# EAGLE design v2 (EAGLE 6.1)
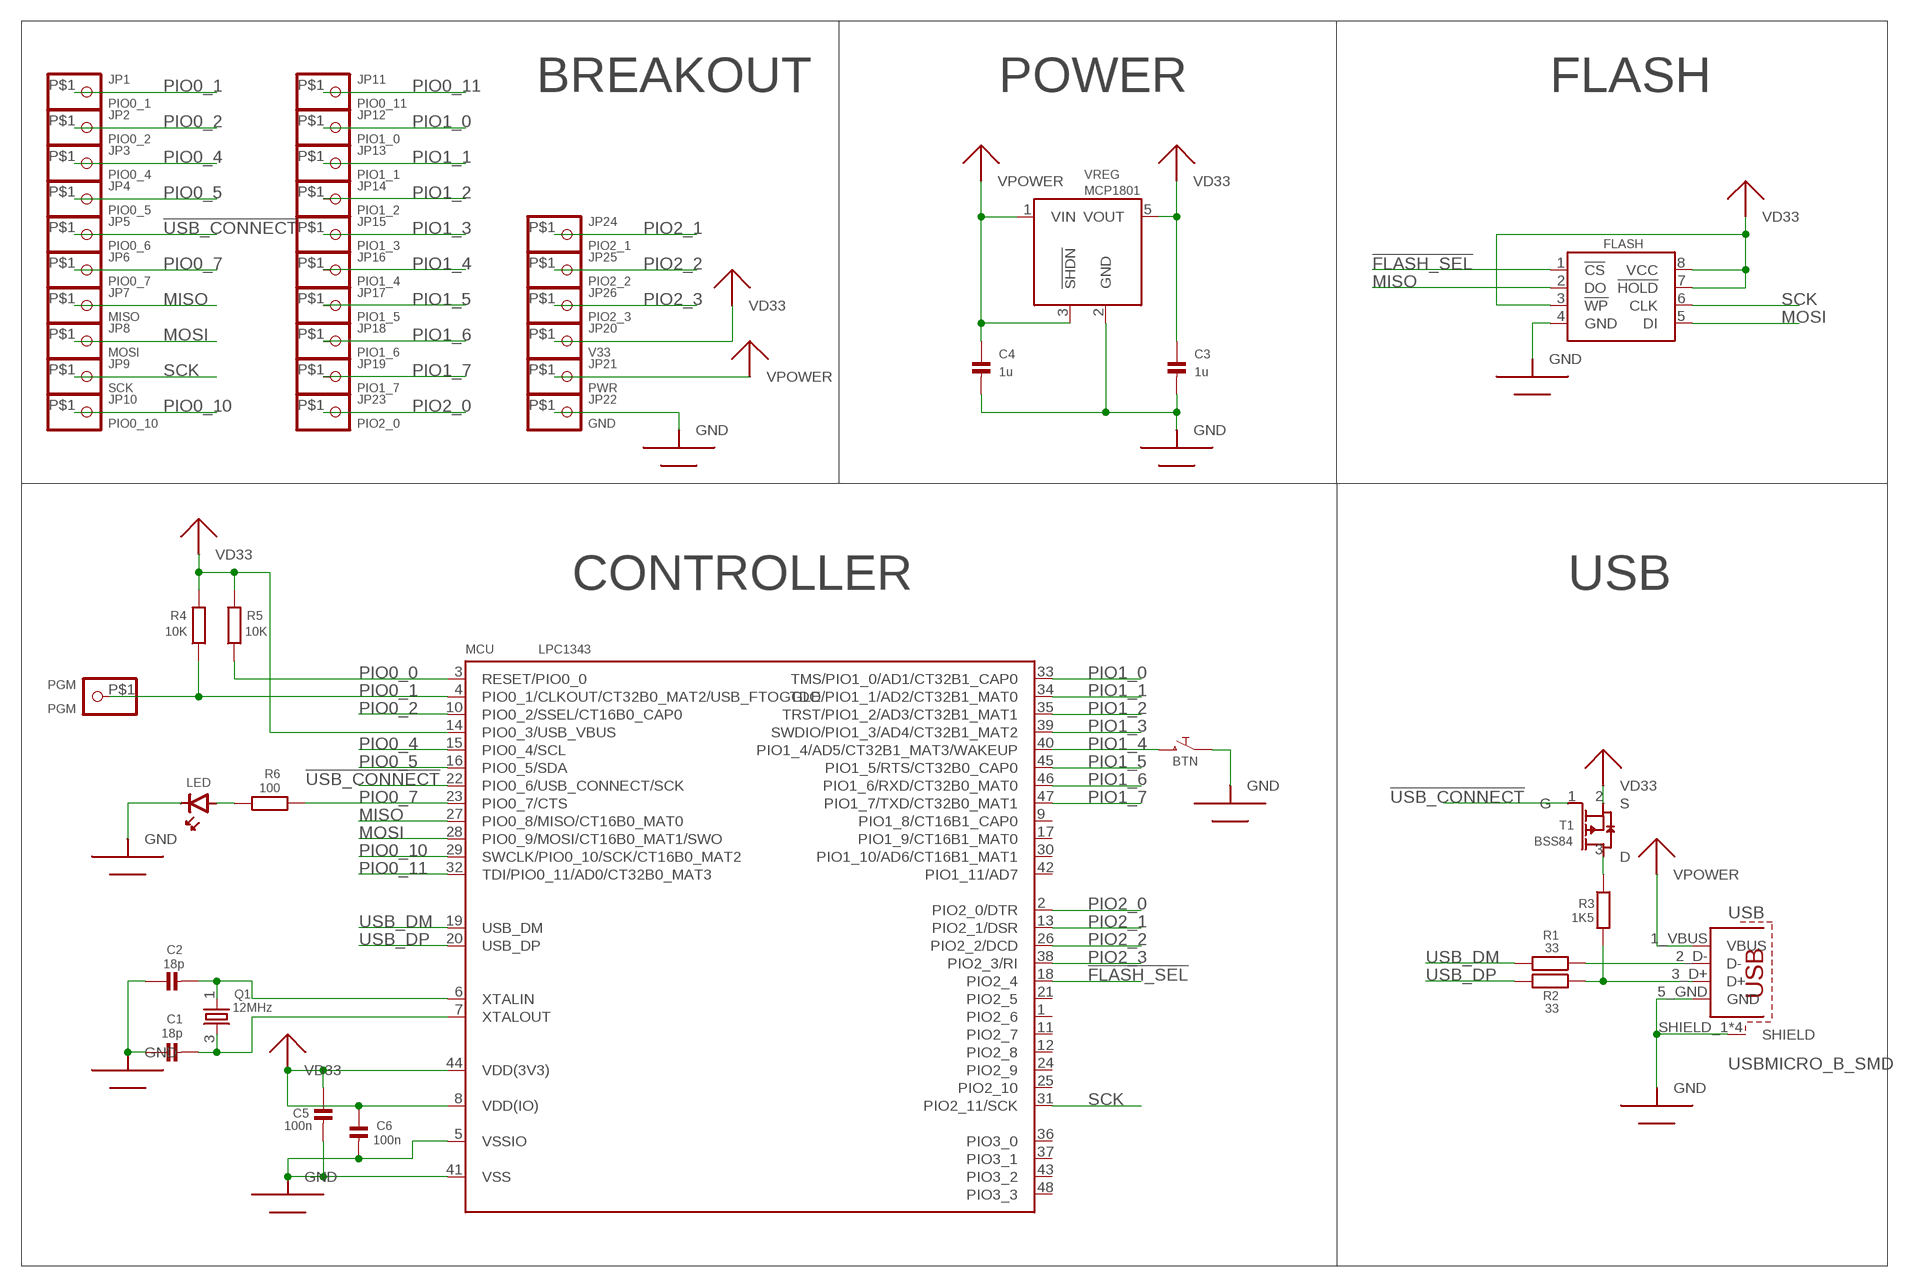
[diagram p0: schematic, sheet 1]

## Parts
BTN  PUSHBUTTONEVQP0  [EVQP0]
C1  18p  CAP_CERAMIC0805_MICROMELF_COMBO  [0805_MICROMELF_COMBO]
C2  18p  CAP_CERAMIC0805_MICROMELF_COMBO  [0805_MICROMELF_COMBO]
C3  1u  CAP_CERAMIC0805_MICROMELF_COMBO  [0805_MICROMELF_COMBO]
C4  1u  CAP_CERAMIC0805_MICROMELF_COMBO  [0805_MICROMELF_COMBO]
C5  100n  CAP_CERAMIC0805_MICROMELF_COMBO  [0805_MICROMELF_COMBO]
C6  100n  CAP_CERAMIC0805_MICROMELF_COMBO  [0805_MICROMELF_COMBO]
FLASH  SERIALFLASHSOIC8-150MIL  [SOIC8-150MIL]
JP1  PIO0_1  HEADER-1X1SMD_MEDIUM  [PCB_MEDIUM_RECT_PAD]
JP2  PIO0_2  HEADER-1X1SMD_MEDIUM  [PCB_MEDIUM_RECT_PAD]
JP3  PIO0_4  HEADER-1X1SMD_MEDIUM  [PCB_MEDIUM_RECT_PAD]
JP4  PIO0_5  HEADER-1X1SMD_MEDIUM  [PCB_MEDIUM_RECT_PAD]
JP5  PIO0_6  HEADER-1X1SMD_MEDIUM  [PCB_MEDIUM_RECT_PAD]
JP6  PIO0_7  HEADER-1X1SMD_MEDIUM  [PCB_MEDIUM_RECT_PAD]
JP7  MISO  HEADER-1X1SMD_MEDIUM  [PCB_MEDIUM_RECT_PAD]
JP8  MOSI  HEADER-1X1SMD_MEDIUM  [PCB_MEDIUM_RECT_PAD]
JP9  SCK  HEADER-1X1SMD_MEDIUM  [PCB_MEDIUM_RECT_PAD]
JP10  PIO0_10  HEADER-1X1SMD_MEDIUM  [PCB_MEDIUM_RECT_PAD]
JP11  PIO0_11  HEADER-1X1SMD_MEDIUM  [PCB_MEDIUM_RECT_PAD]
JP12  PIO1_0  HEADER-1X1SMD_MEDIUM  [PCB_MEDIUM_RECT_PAD]
JP13  PIO1_1  HEADER-1X1SMD_MEDIUM  [PCB_MEDIUM_RECT_PAD]
JP14  PIO1_2  HEADER-1X1SMD_MEDIUM  [PCB_MEDIUM_RECT_PAD]
JP15  PIO1_3  HEADER-1X1SMD_MEDIUM  [PCB_MEDIUM_RECT_PAD]
JP16  PIO1_4  HEADER-1X1SMD_MEDIUM  [PCB_MEDIUM_RECT_PAD]
JP17  PIO1_5  HEADER-1X1SMD_MEDIUM  [PCB_MEDIUM_RECT_PAD]
JP18  PIO1_6  HEADER-1X1SMD_MEDIUM  [PCB_MEDIUM_RECT_PAD]
JP19  PIO1_7  HEADER-1X1SMD_MEDIUM  [PCB_MEDIUM_RECT_PAD]
JP20  V33  HEADER-1X1SMD_MEDIUM  [PCB_MEDIUM_RECT_PAD]
JP21  PWR  HEADER-1X1SMD_MEDIUM  [PCB_MEDIUM_RECT_PAD]
JP22  GND  HEADER-1X1SMD_MEDIUM  [PCB_MEDIUM_RECT_PAD]
JP23  PIO2_0  HEADER-1X1SMD_MEDIUM  [PCB_MEDIUM_RECT_PAD]
JP24  PIO2_1  HEADER-1X1SMD_MEDIUM  [PCB_MEDIUM_RECT_PAD]
JP25  PIO2_2  HEADER-1X1SMD_MEDIUM  [PCB_MEDIUM_RECT_PAD]
JP26  PIO2_3  HEADER-1X1SMD_MEDIUM  [PCB_MEDIUM_RECT_PAD]
LED  LED0805  [0805_POLAR]
MCU  LPC1343  LPC1343_QFP  [LQFP48]
PGM  PGM  HEADER-1X1SMD_MEDIUM  [PCB_MEDIUM_RECT_PAD]
Q1  12MHz  QUARTZABM8G  [ABM8G]
R1  33  R-EU_0805_MICROMELF_COMBO  [0805_MICROMELF_COMBO]
R2  33  R-EU_0805_MICROMELF_COMBO  [0805_MICROMELF_COMBO]
R3  1K5  R-EU_0805_MICROMELF_COMBO  [0805_MICROMELF_COMBO]
R4  10K  R-EU_0805_MICROMELF_COMBO  [0805_MICROMELF_COMBO]
R5  10K  R-EU_0805_MICROMELF_COMBO  [0805_MICROMELF_COMBO]
R6  100  R-EU_0805_MICROMELF_COMBO  [0805_MICROMELF_COMBO]
T1  BSS84  PMOS_ENH  [SOT23]
USB  USBMICRO_B_SMD  [MICRO_USB_B_SMD]
VREG  MCP1801  MCP180XSOT-23-5  [SOT-23-5]

## Nets
!FLASH_SEL: FLASH.1(!CS) MCU.18(PIO2_4)
!USB_CONNECT: JP5.P$1 MCU.22(PIO0_6/USB_CONNECT/SCK) T1.1(G)
GND: BTN.A C1.1 C2.1 C3.2 C4.2 C5.2 C6.2 FLASH.4(GND) JP22.P$1 LED.K(CATHODE) MCU.5(VSSIO) MCU.41(VSS) USB.5_GND(GND) USB.SHIELD_1(SHIELD) USB.SHIELD_2(SHIELD) USB.SHIELD_3(SHIELD) USB.SHIELD_4(SHIELD) VREG.2(GND)
MISO: FLASH.2(DO) JP7.P$1 MCU.27(PIO0_8/MISO/CT16B0_MAT0)
MOSI: FLASH.5(DI) JP8.P$1 MCU.28(PIO0_9/MOSI/CT16B0_MAT1/SWO)
N$1: C2.2 MCU.6(XTALIN) Q1.1
N$2: C1.2 MCU.7(XTALOUT) Q1.3
N$3: R3.1 T1.3(D)
N$4: R1.1 USB.2_D-(D-)
N$5: LED.A(ANODE) R6.1
PIO0_0: MCU.3(RESET/PIO0_0) R5.1
PIO0_1: JP1.P$1 MCU.4(PIO0_1/CLKOUT/CT32B0_MAT2/USB_FTOGGLE) PGM.P$1 R4.1
PIO0_2: JP2.P$1 MCU.10(PIO0_2/SSEL/CT16B0_CAP0)
PIO0_4: JP3.P$1 MCU.15(PIO0_4/SCL)
PIO0_5: JP4.P$1 MCU.16(PIO0_5/SDA)
PIO0_7: JP6.P$1 MCU.23(PIO0_7/CTS) R6.2
PIO0_10: JP10.P$1 MCU.29(SWCLK/PIO0_10/SCK/CT16B0_MAT2)
PIO0_11: JP11.P$1 MCU.32(TDI/PIO0_11/AD0/CT32B0_MAT3)
PIO1_0: JP12.P$1 MCU.33(TMS/PIO1_0/AD1/CT32B1_CAP0)
PIO1_1: JP13.P$1 MCU.34(TDO/PIO1_1/AD2/CT32B1_MAT0)
PIO1_2: JP14.P$1 MCU.35(TRST/PIO1_2/AD3/CT32B1_MAT1)
PIO1_3: JP15.P$1 MCU.39(SWDIO/PIO1_3/AD4/CT32B1_MAT2)
PIO1_4: BTN.B JP16.P$1 MCU.40(PIO1_4/AD5/CT32B1_MAT3/WAKEUP)
PIO1_5: JP17.P$1 MCU.45(PIO1_5/RTS/CT32B0_CAP0)
PIO1_6: JP18.P$1 MCU.46(PIO1_6/RXD/CT32B0_MAT0)
PIO1_7: JP19.P$1 MCU.47(PIO1_7/TXD/CT32B0_MAT1)
PIO2_0: JP23.P$1 MCU.2(PIO2_0/DTR)
PIO2_1: JP24.P$1 MCU.13(PIO2_1/DSR)
PIO2_2: JP25.P$1 MCU.26(PIO2_2/DCD)
PIO2_3: JP26.P$1 MCU.38(PIO2_3/RI)
SCK: FLASH.6(CLK) JP9.P$1 MCU.31(PIO2_11/SCK)
USB_D+: R2.1 R3.2 USB.3_D+(D+)
USB_DM: MCU.19(USB_DM) R1.2
USB_DP: MCU.20(USB_DP) R2.2
VD33: C3.1 C5.1 C6.1 FLASH.3(!WP) FLASH.7(!HOLD) FLASH.8(VCC) JP20.P$1 MCU.8(VDD(IO)) MCU.14(PIO0_3/USB_VBUS) MCU.44(VDD(3V3)) R4.2 R5.2 T1.2(S) VREG.5(VOUT)
VPOWER: C4.1 JP21.P$1 USB.1_VBUS(VBUS) VREG.1(VIN) VREG.3(!SHDN)
Unconnected: MCU.1(PIO2_6) MCU.9(PIO1_8/CT16B1_CAP0) MCU.11(PIO2_7) MCU.12(PIO2_8) MCU.17(PIO1_9/CT16B1_MAT0) MCU.21(PIO2_5) MCU.24(PIO2_9) MCU.25(PIO2_10) MCU.30(PIO1_10/AD6/CT16B1_MAT1) MCU.36(PIO3_0) MCU.37(PIO3_1) MCU.42(PIO1_11/AD7) MCU.43(PIO3_2) MCU.48(PIO3_3)

## Notes on the sheet
- BREAKOUT | POWER | FLASH
- CONTROLLER | USB

## Library data of the parts
BTN = MEINZEUG:PUSHBUTTON: Push button 1 x momentary close switches
C1-C6 = MEINZEUG:CAP_CERAMIC: Ceramic Capacitors 0603 - 0603 Surface Mount Capacitors 3pF 250V +/-0.1pF RF Ceramic Capacitor[Digikey: 712-1347-1-ND] 16 pF 50V 5% Ceramic Capacitor[Digikey: 445-5051-2-ND] 18 pF 250V 5% RF Ceramic Capcitor [Digikey: 478-3505-1-ND] 22 pF 50V Ceramic Capacitor [Digikey: PCC220ACVTR-ND] 33 pF 50V 5% Ceramic Capacitor 56 pF 250V 5% C0G RF Ceramic Capcitor [Digikey: 490-4867-1-ND] 680 pF 50V Ceramic Capacitor 2200 pF 50V 5% C0G Ceramic Capacitor [Digikey: 445-1297-1-ND] 5600 pF 100V 5% X7R Ceramic Capacitor [Digikey: 478-3711-1-ND] 0.1 µF 25V 10% Ceramic Capacitor [Digikey: PCC2277TR-ND] 0.22 µF 16V 10% X7R Ceramic Capacitor [Digikey: 445-1318-1-ND] 1.0 µF 25V 10% Ceramic Capacitor [Digikey: 445-5146-2-ND] 0805 - 0805 Surface Mount Capacitors 220 pF 250V 2% RF Ceramic Capacitor [Digikey: 712-1398-1-ND] 1000 pF 50V 2% NP0 Ceramic Capacitor [Digikey: 478-3760-1-ND] 0.1 µF 25V 10% Ceramic Capacitor [Digikey: PCC1828TR-ND] 1.0 µF 16V 10% Ceramic Capacitor[Digikey: 490-1691-2-ND] 10.0 µF 10V 10% Ceramic Capacitor[Digikey: 709-1228-1-ND] 1206 - 1206 Surface Mount Capacitors
FLASH = MEINZEUG:SERIALFLASH: SPI flash chip. Uses common pinout (Winbond, Macronix, Microchip, Numonyx, ...) - check for different pinouts (e.g. Atmel)
JP1-JP26 PGM = MEINZEUG:HEADER-1X1: PIN HEADER
LED = MEINZEUG:LED: LED common
MCU = MEINZEUG:LPC1343_QFP: LPC1343 72 MHz 32-bit ARM Cortex-M3 microcontroller. 32 kB Flash, 8 kB SRAM, USB Device Mouser: 771-LPC1343FBD48151 Digikey: 568-4945-ND
Q1 = MEINZEUG:QUARTZ
R1-R6 = MEINZEUG:R-EU_: RESISTOR, European symbol
T1 = MEINZEUG:PMOS_ENH: P-Channel MOSFET, enhancement type
USB = MEINZEUG:USB: BERG USB connector
VREG = MEINZEUG:MCP180X: Cheap Microchip LDO

## Board
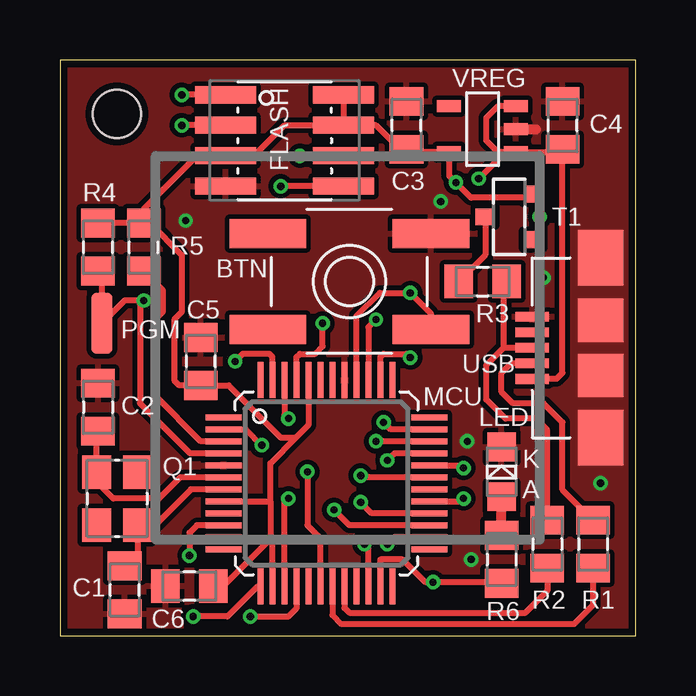
[diagram p1: board, top side]
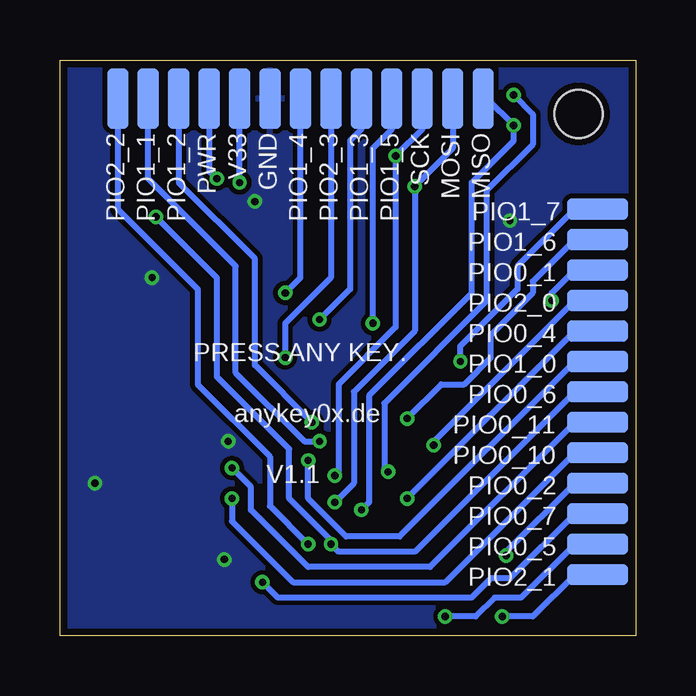
[diagram p2: board, bottom side, seen from below]

Size 24 x 24 mm. Coordinates in mm from the lower left corner, seen from the top.
Outline: 0,0 24,0 24,24 0,24 0,0
Copper layers (1*16): Top 0.035mm / dielectric 1.5mm / Bottom 0.035mm
Design rules: minimum track width 0.2mm, minimum drill 0.3mm, track to track 0.2mm, track to pad 0.2mm, pad to pad 0.2mm, via to via 0.2mm, smd to smd 0.2mm, copper to edge 0.3mm, drill to drill 0.2mm, minimum pad ring 0.2mm, minimum via ring 0.15mm, stop-mask expansion 0.075mm, vias tented up to drill 12mil, thermal gap 0.2mm
Holes 2 mm at 2.38,21.75
tKeepout: area 0,22.5 to 1.5,24; area 22.5,22.5 to 24,24; area 0,0 to 1.5,1.5; area 22.5,0 to 24,1.5

### Footprints (pad centres in the part's own frame; a part is rotated, then mirrored left to right if it is on the bottom)
EVQP0 = smd 3.2 x 1.2: A -3.4,-2; A' 3.4,-2; B -3.4,2; B' 3.4,2
0805_MICROMELF_COMBO = smd 1.2 x 1.4: 1 -1,0; 2 1,0
SOIC8-150MIL = smd 2.54 x 0.711: 1 -2.464,1.905; 2 -2.464,0.635; 3 -2.464,-0.635; 4 -2.464,-1.905; 5 2.464,-1.905; 6 2.464,-0.635; 7 2.464,0.635; 8 2.464,1.905
PCB_MEDIUM_RECT_PAD = smd 2.54 x 0.889: P$1 0,0
0805_POLAR = smd 1.194 x 1.194: A -1.041,0; K 1.041,0
LQFP48 = smd 1.5 x 0.25: 1 -4.3,2.75; 2 -4.3,2.25; 3 -4.3,1.75; 4 -4.3,1.25; 5 -4.3,0.75; 6 -4.3,0.25; 7 -4.3,-0.25; 8 -4.3,-0.75; 9 -4.3,-1.25; 10 -4.3,-1.75; 11 -4.3,-2.25; 12 -4.3,-2.75; 25 4.3,-2.75; 26 4.3,-2.25; 27 4.3,-1.75; 28 4.3,-1.25; 29 4.3,-0.75; 30 4.3,-0.25; 31 4.3,0.25; 32 4.3,0.75; 33 4.3,1.25; 34 4.3,1.75; 35 4.3,2.25; 36 4.3,2.75 | smd 0.25 x 1.5: 13 -2.75,-4.3; 14 -2.25,-4.3; 15 -1.75,-4.3; 16 -1.25,-4.3; 17 -0.75,-4.3; 18 -0.25,-4.3; 19 0.25,-4.3; 20 0.75,-4.3; 21 1.25,-4.3; 22 1.75,-4.3; 23 2.25,-4.3; 24 2.75,-4.3; 37 2.75,4.3; 38 2.25,4.3; 39 1.75,4.3; 40 1.25,4.3; 41 0.75,4.3; 42 0.25,4.3; 43 -0.25,4.3; 44 -0.75,4.3; 45 -1.25,4.3; 46 -1.75,4.3; 47 -2.25,4.3; 48 -2.75,4.3
ABM8G = smd 1.397 x 1.194: 1 -1.105,-0.851; 2 1.105,-0.851; 3 1.105,0.851; 4 -1.105,0.851
SOT23 = smd 0.7 x 0.8: 1 -0.95,-1; 2 0.95,-1; 3 0,1
MICRO_USB_B_SMD = smd 0.4 x 1.4: 1_VBUS -1.3,2.85; 2_D- -0.65,2.85; 3_D+ 0,2.85; 4_ID_NC 0.65,2.85; 5_GND 1.3,2.85 | smd 2.3 x 1.9: SHIELD_1 -3.75,0; SHIELD_4 3.75,0 | smd 1.8 x 1.9: SHIELD_2 -1.15,0; SHIELD_3 1.15,0
SOT-23-5 = smd 0.5 x 1: 1 -0.95,-1.397; 2 0,-1.397; 3 0.95,-1.397; 4 0.95,1.397; 5 -0.95,1.397

### Placement (x,y rotation side)
BTN  12.06,14.76 180 top
C1  2.7,1.91 90 top
C2  1.59,9.53 270 top
C3  14.45,21.27 90 top
C4  20.95,21.27 90 top
C5  5.87,11.43 90 top
C6  5.4,2.06 180 top
FLASH  9.37,20.64 0 top
JP1  1.59,15.24 180 bottom
JP2  1.59,6.35 180 bottom
JP3  1.59,12.7 180 bottom
JP4  1.59,3.81 180 bottom
JP5  1.59,10.16 180 bottom
JP6  1.59,5.08 180 bottom
JP7  6.35,22.38 270 bottom
JP8  7.62,22.38 270 bottom
JP9  8.89,22.38 270 bottom
JP10  1.59,7.62 180 bottom
JP11  1.59,8.89 180 bottom
JP12  1.59,11.43 180 bottom
JP13  20.32,22.38 270 bottom
JP14  19.05,22.38 270 bottom
JP15  11.43,22.38 270 bottom
JP16  13.97,22.38 270 bottom
JP17  10.16,22.38 270 bottom
JP18  1.59,16.51 180 bottom
JP19  1.59,17.78 180 bottom
JP20  16.51,22.38 270 bottom
JP21  17.78,22.38 270 bottom
JP22  15.24,22.38 270 bottom
JP23  1.59,13.97 180 bottom
JP24  1.59,2.54 180 bottom
JP25  21.59,22.38 270 bottom
JP26  12.7,22.38 270 bottom
LED  18.41,6.83 90 top
MCU  11.11,6.35 0 top
PGM  1.75,13.02 270 top
Q1  2.38,5.71 270 top
R1  22.23,3.81 270 top
R2  20.32,3.81 270 top
R3  17.62,14.76 0 top
R4  1.59,16.19 90 top
R5  3.49,16.19 90 top
R6  18.41,3.17 270 top
T1  18.73,17.46 90 top
USB  22.54,12 90 top
VREG  17.62,21.11 90 top

### Tracks (layer width: path | path; a pad name or v marks a point on that pad's centre or on a via)
!FLASH_SEL  (via drill 0.3)
  Top 0.254: FLASH.1 v5.08,22.54 | MCU.18 10.86,4.06 10.32,4.6 v10.32,6.83
  Bottom 0.254: v5.08,22.54 4.29,21.75 4.29,20.48 6.19,18.57 6.19,13.97 10.48,9.68 10.48,6.99 v10.32,6.83
!USB_CONNECT  (via drill 0.3)
  Top 0.254: 19.68,16.56 T1.1 19.76,16.51 19.76,16.59 | MCU.22 12.86,3.65 v12.7,3.81 | v20,17.46 20,16.83 19.76,16.59 | 19.76,16.59 19.68,16.51
  Bottom 0.254: JP5.P$1 2.54,10.16 9.21,3.49 12.38,3.49 v12.7,3.81 12.7,3.97 14.45,5.71 14.45,7.78 17.46,10.79 17.46,14.92 v20,17.46
GND  (via drill 0.3)
  Top 0.406: VREG.2 19.84,21.11
  other vias: 15.88,18.1 17.14,3.17 16.99,8.1 22.54,6.35 20.16,14.92 5.24,17.3
  pour Top (isolate 0.051): 0,0 0,24 24,24 24,0
  pour Bottom (isolate 0.051): 0,0 24,0 24,24 0,24
MISO  (via drill 0.3)
  Top 0.254: FLASH.2 v5.08,21.27 | MCU.27 12.07,4.6 v11.43,5.24
  Bottom 0.254: v11.43,5.24 11.11,5.56 11.11,10 6.83,14.29 6.83,18.89 5.08,20.64 v5.08,21.27 6.19,22.38 JP7.P$1
MOSI  (via drill 0.3)
  Top 0.254: MCU.28 13,5.1 v12.54,5.56 | FLASH.5 v9.21,18.73
  Bottom 0.254: v12.54,5.56 11.75,6.35 11.75,10.16 9.21,12.7 v9.21,18.73 7.62,20.32 JP8.P$1
N$1
  Top 0.254: MCU.6 5.01,6.6 4.13,5.71 2.22,5.71 1.53,6.41 Q1.1 1.53,8.47 C2.2
N$2
  Top 0.254: MCU.7 5.46,6.1 3.97,4.6 Q1.3 | C1.2 3.23,3.44 Q1.3 | 3.17,4.6 Q1.3
N$3
  Top 0.254: T1.3 17.73,15.88 R3.1
N$4
  Top 0.254: R1.1 20.95,6.08 20.95,8.89 20.16,9.68 18.89,9.68 18.41,10.16 18.41,10.95 18.81,11.35 USB.2_D-
N$5
  Top 0.406: R6.1 LED.A
PIO0_0
  Top 0.254: MCU.3 5.87,8.1 3.97,10 3.97,13.18 4.29,13.49 4.29,14.4 R5.1
PIO0_1  (via drill 0.3)
  Top 0.254: MCU.4 5.42,7.6 3.33,9.68 3.33,13.81 v3.49,13.97 2.7,13.97 PGM.P$1 1.75,15.19 R4.1
  Bottom 0.254: JP1.P$1 2.54,15.24 3.49,14.29 v3.49,13.97
PIO0_2  (via drill 0.3)
  Top 0.254: MCU.10 5.71,4.6 5.4,4.29 v5.4,3.33
  Bottom 0.254: JP2.P$1 2.54,6.35 5.4,3.49 v5.4,3.33
PIO0_4  (via drill 0.3)
  Top 0.254: MCU.15 9.36,5.55 v9.53,5.71
  Bottom 0.254: v9.53,5.71 2.54,12.7 JP3.P$1
PIO0_5  (via drill 0.3)
  Top 0.254: MCU.16 9.86,1.13 9.53,0.79 v7.94,0.79
  Bottom 0.254: v7.94,0.79 6.67,0.79 5.87,1.59 4.76,1.59 2.54,3.81 JP4.P$1
PIO0_7  (via drill 0.3)
  Top 0.254: 18.33,2.22 v15.56,2.22 15.24,2.22 14.29,3.17 13.36,3.17 MCU.23
  Top 0.406: 18.33,2.22 18.41,2.22 R6.2
  Bottom 0.254: v15.56,2.22 14.92,1.59 6.83,1.59 6.03,2.38 5.24,2.38 2.54,5.08 JP6.P$1
PIO0_10  (via drill 0.3)
  Top 0.254: MCU.29 16.71,5.6 v16.83,5.71
  Bottom 0.254: v16.83,5.71 16.83,4.76 14.29,2.22 7.94,2.22 2.54,7.62 JP10.P$1
PIO0_11  (via drill 0.3)
  Top 0.254: MCU.32 16.71,7.1 v16.83,6.99
  Bottom 0.254: v16.83,6.99 16.03,6.19 16.03,5.24 13.65,2.86 8.57,2.86 2.54,8.89 JP11.P$1
PIO1_0  (via drill 0.3)
  Top 0.254: MCU.33 13.95,7.6 v13.65,7.3
  Bottom 0.254: v13.65,7.3 13.65,5.71 12.06,4.13 9.84,4.13 2.54,11.43 JP12.P$1
PIO1_1  (via drill 0.3)
  Top 0.254: MCU.34 v13.18,8.1
  Bottom 0.254: v13.18,8.1 13.81,8.1 16.67,10.95 16.67,15.4 20.32,19.05 JP13.P$1
PIO1_2  (via drill 0.3)
  Top 0.254: MCU.35 13.78,8.6 v13.49,8.89
  Bottom 0.254: v13.49,8.89 15.88,11.27 15.88,15.72 19.05,18.89 JP14.P$1
PIO1_3  (via drill 0.3)
  Top 0.254: v13.18,13.18 12.86,12.86 MCU.39
  Bottom 0.254: JP15.P$1 11.43,21.11 11.91,20.64 11.91,14.45 v13.18,13.18
PIO1_4  (via drill 0.3)
  Top 0.254: MCU.40 12.36,13.31 13.34,14.29 v14.61,14.29 15.46,13.43 BTN.B
  Bottom 0.254: v14.61,14.29 13.97,14.92 JP16.P$1
PIO1_5  (via drill 0.3)
  Top 0.254: MCU.45 9.86,11.61 10,11.75 10.64,11.75 10.95,12.06 v10.95,13.02
  Bottom 0.254: v10.95,13.02 10.95,20.32 10.16,21.11 JP17.P$1
PIO1_6  (via drill 0.3)
  Top 0.254: MCU.46 9.36,9.21 v9.53,9.05
  Bottom 0.254: v9.53,9.05 8.1,10.48 7.14,10.48 6.03,11.59 6.03,12.54 4.29,14.29 4.29,14.76 2.54,16.51 JP18.P$1
PIO1_7  (via drill 0.3)
  Top 0.254: MCU.47 8.86,11.62 8.73,11.75 7.62,11.75 v7.3,11.43
  Bottom 0.254: v7.3,11.43 7.3,12.06 4.92,14.45 4.92,15.4 2.54,17.78 JP19.P$1
PIO2_0  (via drill 0.3)
  Top 0.254: MCU.2 7.75,8.6 v8.41,7.94
  Bottom 0.254: JP23.P$1 2.54,13.97 8.41,8.1 v8.41,7.94
PIO2_1  (via drill 0.3)
  Top 0.254: MCU.13 8.24,2.05 6.99,0.79 v5.56,0.79
  Bottom 0.254: JP24.P$1 2.54,2.54 4.29,0.79 v5.56,0.79
PIO2_2  (via drill 0.3)
  Top 0.254: MCU.26 13.94,4.1 v13.65,3.81
  Bottom 0.254: v13.65,3.81 15.24,5.4 15.24,7.46 18.26,10.48 18.26,14.45 21.59,17.78 JP25.P$1
PIO2_3  (via drill 0.3)
  Top 0.254: MCU.38 13.36,11.62 13.49,11.75 14.45,11.75 v14.61,11.59
  Bottom 0.254: JP26.P$1 12.7,14.92 14.61,13.02 v14.61,11.59
SCK  (via drill 0.3)
  Top 0.254: MCU.31 12.61,6.6 v12.54,6.67 | FLASH.6 v10,20
  Bottom 0.254: v12.54,6.67 12.38,6.83 12.38,10.48 10,12.86 v10,20 8.89,21.11 JP9.P$1
USB_D+
  Top 0.254: R2.1 20.32,8.57 19.84,9.05 18.57,9.05 17.78,9.84 17.78,11.27 18.51,12 | 18.51,12 USB.3_D+ | 18.51,12 18.51,14.65 R3.2
USB_DM
  Top 0.254: MCU.19 11.36,0.86 11.75,0.48 21.43,0.48 22.23,1.27 R1.2
USB_DP
  Top 0.254: MCU.20 11.86,1.16 12.06,0.95 19.41,0.95 20.32,1.86 R2.2
VD33  (via drill 0.3)
  Top 0.254: MCU.8 8.78,5.6 | 8.78,5.6 8.78,3.96 | MCU.14 8.86,3.88 8.78,3.96 | R5.2 R4.2 | R5.2 3.76,17.19 5.08,15.88 5.08,13.49 4.76,13.18 4.76,10.64 4.97,10.43 C5.1 7.03,10.43 9.21,8.26 9.84,8.26 | 8.78,3.96 8.73,3.96 6.83,2.06 C6.1 | R5.2 3.49,17.78 5.71,20 FLASH.3 8.1,20 9.37,21.27 FLASH.7 | MCU.44 10.36,8.78 9.84,8.26 | 8.78,5.6 8.78,7.19 9.84,8.26 | T1.2 19.58,18.26 17.14,18.26 v16.51,18.89 | 16.54,18.92 v16.51,18.89 | VREG.5 16.22,19.18 v16.51,18.89 | FLASH.8 FLASH.7 | VREG.5 16.35,20.16 | VREG.5 14.55,20.16 C3.1 14.18,20.27 13.18,21.27 FLASH.7
  Bottom 0.254: v16.51,18.89 JP20.P$1
VPOWER  (via drill 0.3)
  Top 0.254: 18.58,20.16 VREG.1 20.85,20.16 C4.1 20.95,10.95 20.7,10.7 USB.1_VBUS | 18.58,20.16 v17.46,19.05 | VREG.3 18.25,22.06 17.78,21.59 17.78,20.64 18.25,20.16 18.58,20.16
  Bottom 0.254: JP21.P$1 17.78,19.37 v17.46,19.05

### Text on the board
tPlace: K | A
bPlace: PRESS ANY KEY. | anykey0x.de | V1.1